# EAGLE board Relay-Board_Rack-PDU_2.0 (EAGLE 9.2.1)
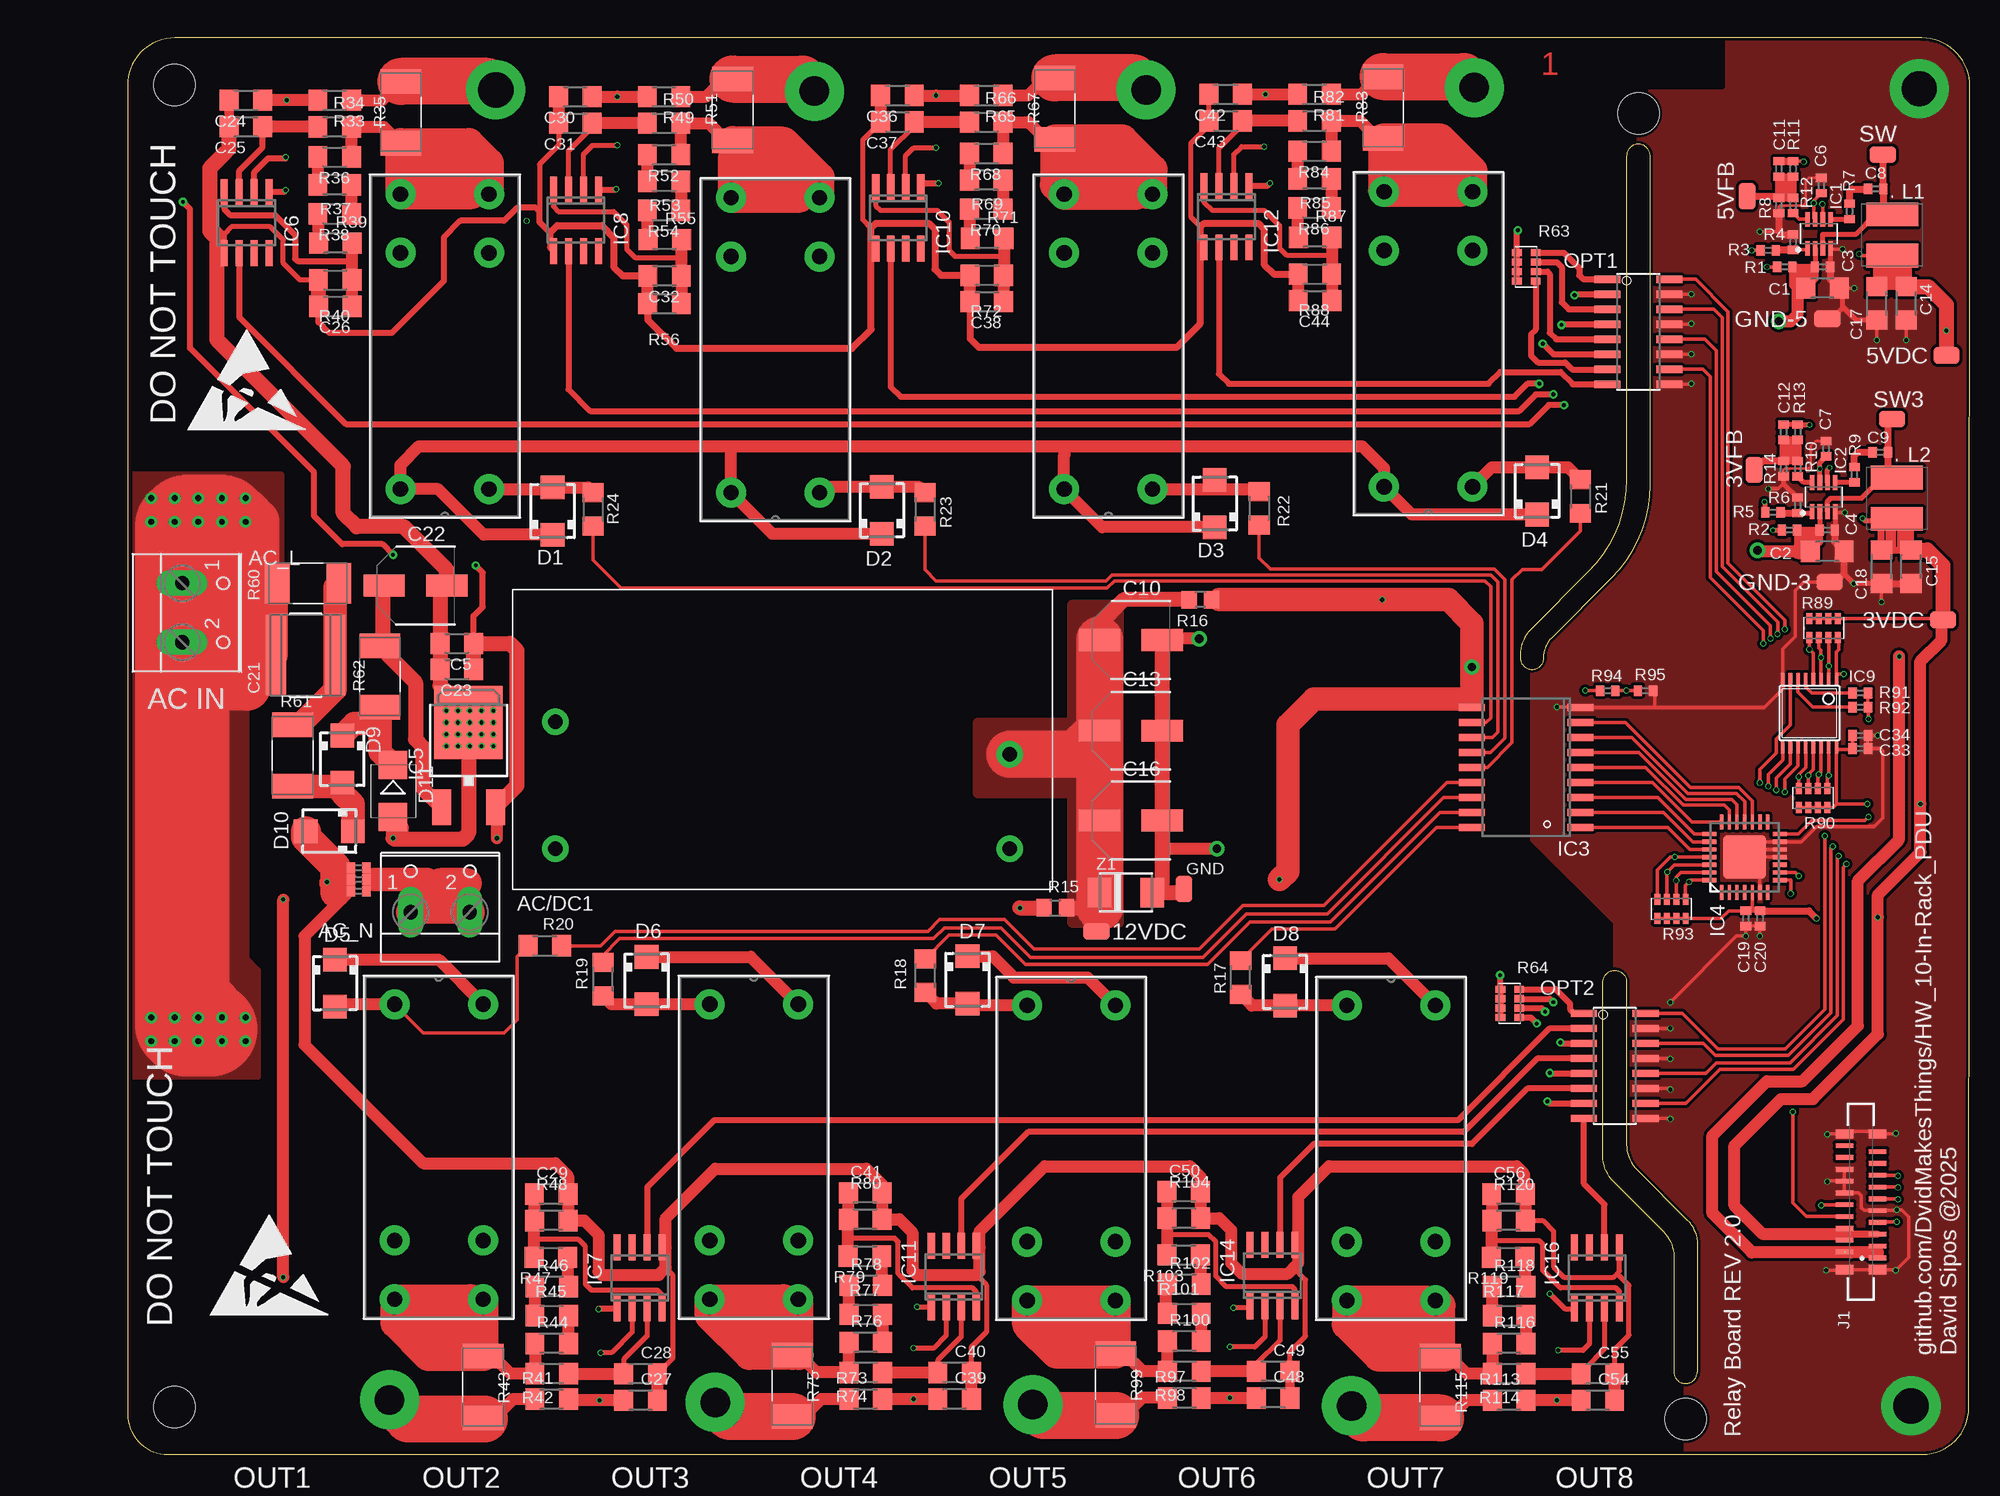
[diagram p3: board, top side]
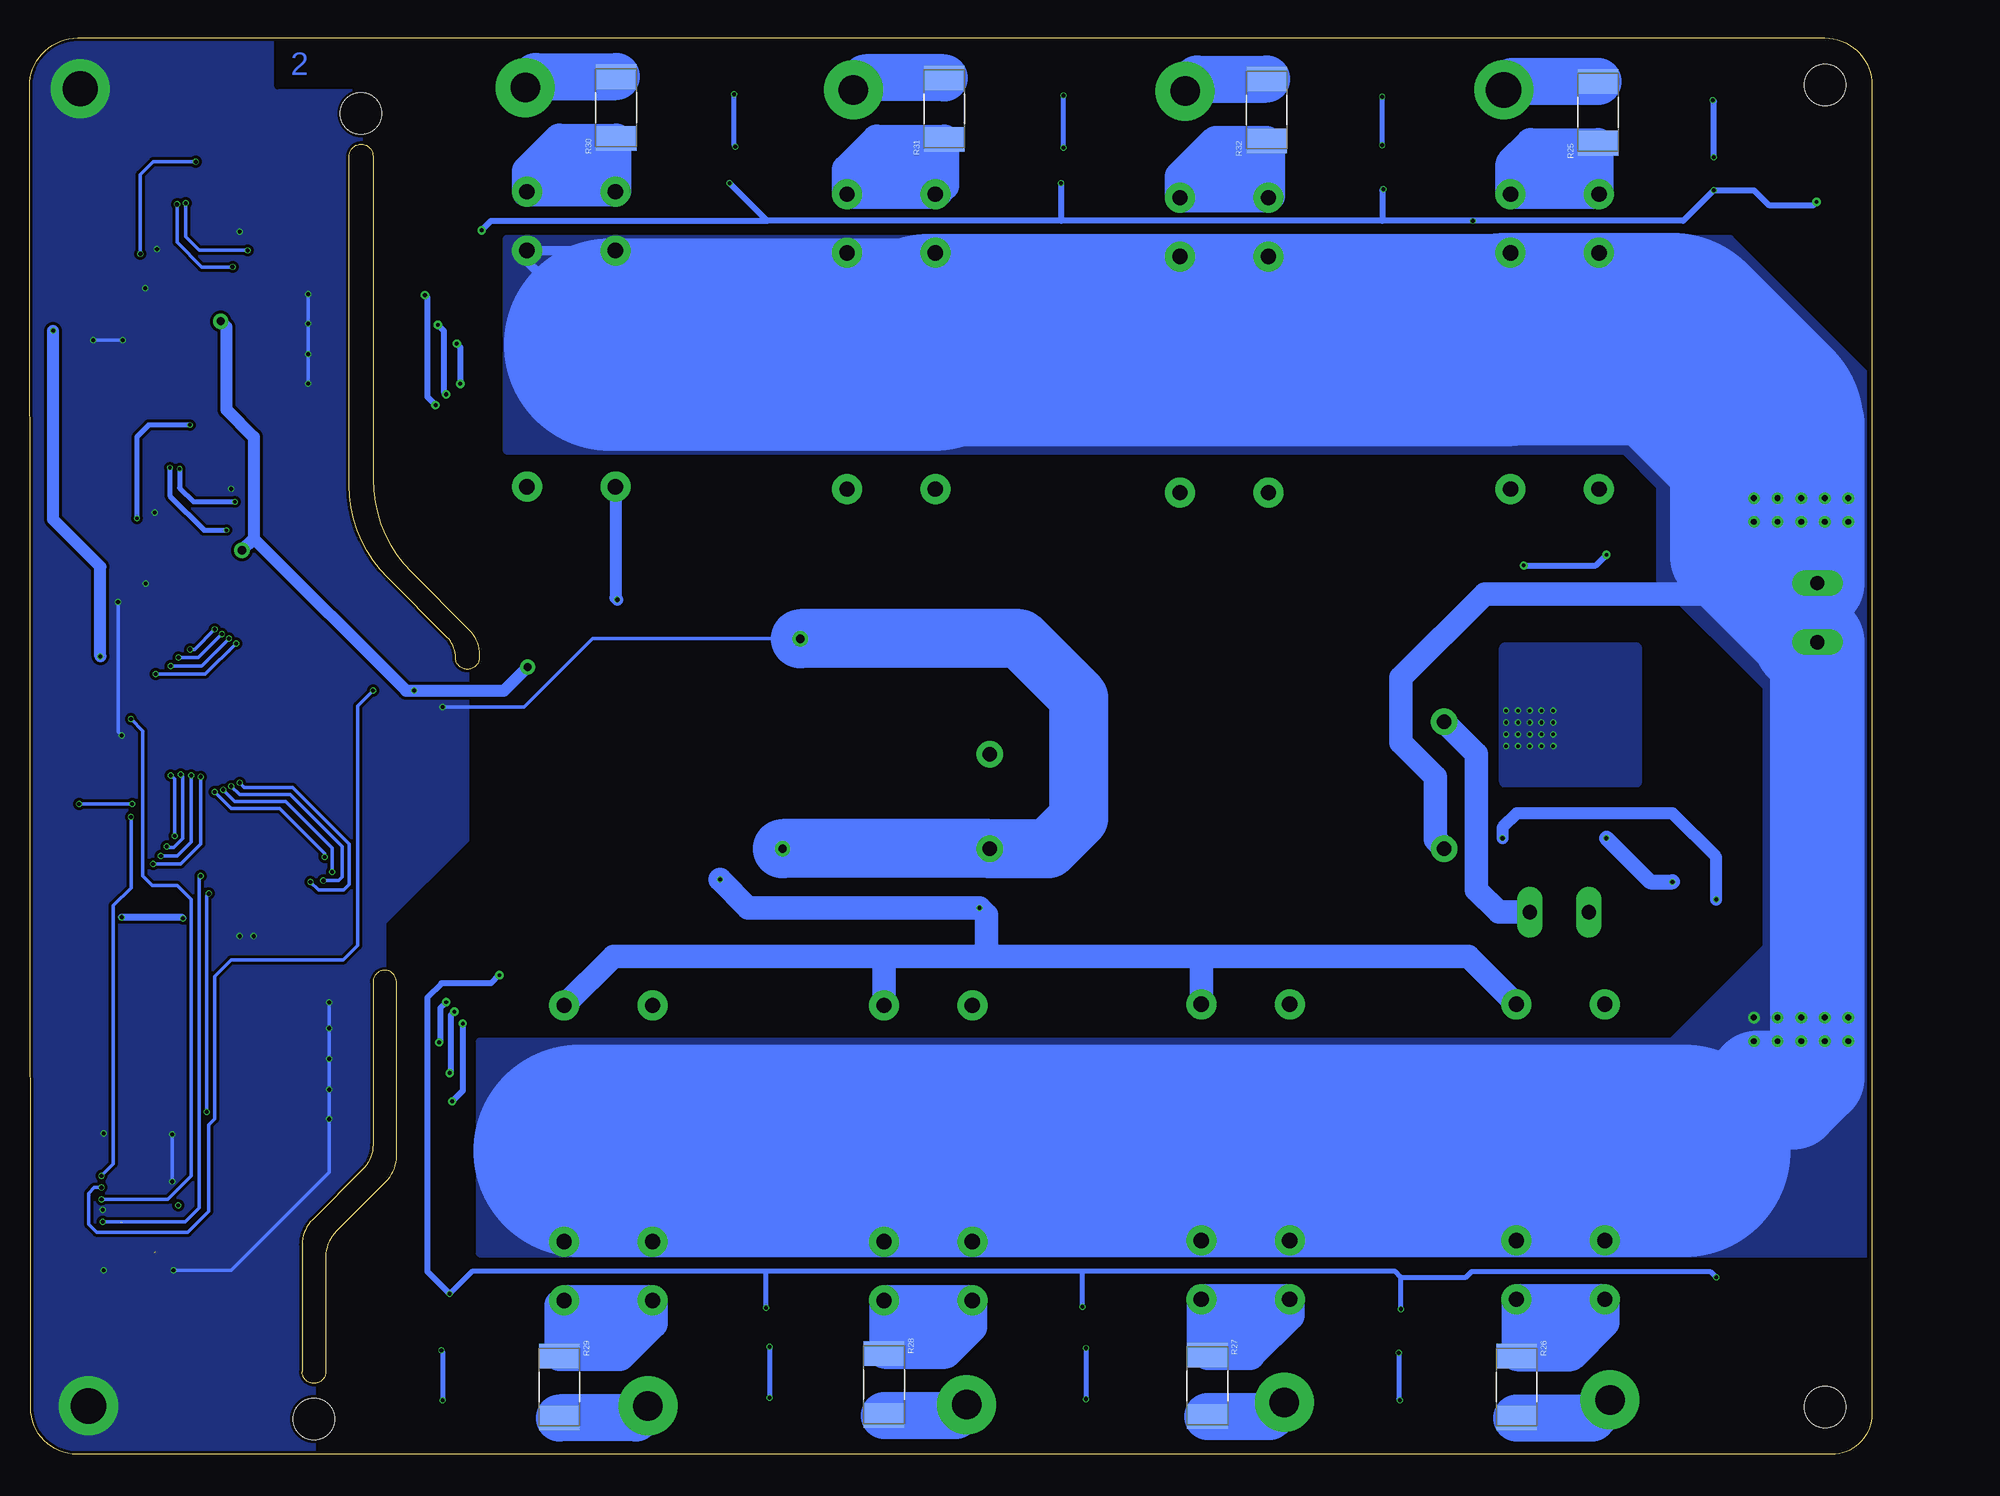
[diagram p4: board, bottom side, seen from below]

Size 156.1 x 120 mm. Coordinates in mm from the lower left corner, seen from the top.
Outline: 3.41,0 152.07,0 arc90 156,3.92 156.1,115.91 arc90 152.01,120 4,120 arc90 0,116 0,3.41 arc90 3.41,0
Outline: 120,67.5 arc-45 120.71,69.21 125.72,74.22 arc45 129,82.14 129,110 arc90 128,111 arc90 127,110 127,82.61 arc-45 123.74,74.74 118.88,69.88 arc45 118,67.76 118,67.5 arc90 119,66.5 arc90 120,67.5
Outline: 125.88,23.12 130.12,18.88 arc-45 131,16.76 131,7 arc90 132,6 arc90 133,7 133,17.76 arc45 132.12,19.88 127.88,24.12 arc-45 127,26.24 127,40 arc90 126,41 arc90 125,40 125,25.24 arc45 125.88,23.12
Copper layers (1*16): Top 0.035mm / dielectric 1.6mm / Bottom 0.035mm
Design rules "jlcpcb-2layers": minimum track width 5mil, minimum drill 0.3mm, track to track 5mil, track to pad 5mil, pad to pad 5mil, via to via 5mil, smd to smd 5mil, copper to edge 0.2mm, drill to drill 6mil, minimum pad ring 10mil, minimum via ring 3mil, stop-mask expansion 4mil, vias tented up to drill 0mil, thermal gap 10mil
Net classes: 0 default: width 0.2 mm, drill 0.3 mm, clearance 0.191 mm
Holes 3.5 mm at 4,116 4,4 132,3 128,113.6

## Footprints (pad centres in the part's own frame; a part is rotated, then mirrored left to right if it is on the bottom)
TP = smd 2.2 x 1.4: TP 0,0
IRM_10_12 = drill 1.24: +V 19.25,0.02; -V 19.25,-7.98; AC_L -19.25,-7.98; AC_N -19.25,2.77
W237-102 = drill 1.194 long: 1 -2.5,-1.27; 2 2.5,-1.27
C1206 = smd 1.6 x 1.803: 1 -1.422,0; 2 1.422,0
0402 = smd 0.7 x 0.9: 1 -0.65,0; 2 0.65,0
100UF-16V = smd 3.5 x 1.85: 1 -2.65,0; 2 2.65,0
C0402 = smd 0.7 x 0.9: 1 -0.65,0; 2 0.65,0
2225 = smd 1.706 x 6.8: 1 -2.503,0; 2 2.503,0
SMA = smd 2 x 2: A 2,0; C -2,0
SMB = smd 2.4 x 2.4: A 2.2,0; C -2.2,0
SOT65P280X110-8N = smd 1.259 x 0.4: 1 -1.228,0.975; 2 -1.228,0.325; 3 -1.228,-0.325; 4 -1.228,-0.975; 5 1.228,-0.975; 6 1.228,-0.325; 7 1.228,0.325; 8 1.228,0.975
SO18 = smd 0.6 x 2.2: 1 -5.08,-4.6; 2 -3.81,-4.6; 3 -2.54,-4.6; 4 -1.27,-4.6; 5 0,-4.6; 6 1.27,-4.6; 7 2.54,-4.6; 8 3.81,-4.6; 9 5.08,-4.6; 10 5.08,4.6; 11 3.81,4.6; 12 2.54,4.6; 13 1.27,4.6; 14 0,4.6; 15 -1.27,4.6; 16 -2.54,4.6; 17 -3.81,4.6; 18 -5.08,4.6
QFN28[6X6]ML = smd 1.27 x 0.35: 1 -2.985,1.95; 2 -2.985,1.3; 3 -2.985,0.65; 4 -2.985,0; 5 -2.985,-0.65; 6 -2.985,-1.3; 7 -2.985,-1.95; 15 2.985,-1.95; 16 2.985,-1.3; 17 2.985,-0.65; 18 2.985,0; 19 2.985,0.65; 20 2.985,1.3; 21 2.985,1.95 | smd 0.35 x 1.27: 8 -1.95,-2.985; 9 -1.3,-2.985; 10 -0.65,-2.985; 11 0,-2.985; 12 0.65,-2.985; 13 1.3,-2.985; 14 1.95,-2.985; 22 1.95,2.985; 23 1.3,2.985; 24 0.65,2.985; 25 0,2.985; 26 -0.65,2.985; 27 -1.3,2.985; 28 -1.95,2.985 | smd 3.7 x 3.7: PAD 0,0
DPAK = smd 1.6 x 3: 1 -2.28,-6.07; 3 2.28,-6.07 | smd 5.8 x 6.2: 4 0,1.11
SO8 = smd 0.6 x 2.2: 1 -1.905,-2.6; 2 -0.635,-2.6; 3 0.635,-2.6; 4 1.905,-2.6; 5 1.905,2.6; 6 0.635,2.6; 7 -0.635,2.6; 8 -1.905,2.6
TSSOP16 = smd 0.305 x 0.991: 1 -2.275,-2.918; 2 -1.625,-2.918; 3 -0.975,-2.918; 4 -0.325,-2.918; 5 0.325,-2.918; 6 0.975,-2.918; 7 1.625,-2.918; 8 2.275,-2.918; 9 2.275,2.918; 10 1.625,2.918; 11 0.975,2.918; 12 0.325,2.918; 13 -0.325,2.918; 14 -0.975,2.918; 15 -1.625,2.918; 16 -2.275,2.918
FPC20 = smd 0.4 x 1.5: 1 -4.552,-1.362; 2 -4.052,1.438; 3 -3.552,-1.362; 4 -3.052,1.438; 5 -2.552,-1.362; 6 -2.052,1.438; 7 -1.552,-1.362; 8 -1.052,1.438; 9 -0.552,-1.362; 10 -0.052,1.438; 11 0.448,-1.362; 12 0.948,1.438; 13 1.448,-1.362; 14 1.948,1.438; 15 2.448,-1.362; 16 2.948,1.438; 17 3.448,-1.362; 18 3.948,1.438; 19 4.448,-1.362; 20 4.948,1.438 | smd 0.8 x 1.5: Z1 -5.552,-1.362; Z2 -5.552,1.438; Z3 5.948,-1.362; Z4 5.948,1.438
RELAY_G2RL-1A-E_DC5_OMR = drill 1.295 pad 2.54: 1 -3.683,12.776; 3 -3.683,-7.239; 4 -3.683,-12.217; 5 3.81,-12.217; 6 3.81,-7.239; 8 3.81,12.776
SRR5228A = smd 4.4 x 2: 1 0,1.75; 2 0,-1.75
SO16 = smd 0.61 x 2.21: 1 -4.445,-2.616; 2 -3.175,-2.616; 3 -1.905,-2.616; 4 -0.635,-2.616; 5 0.635,-2.616; 6 1.905,-2.616; 7 3.175,-2.616; 8 4.445,-2.616; 9 4.445,2.616; 10 3.175,2.616; 11 1.905,2.616; 12 0.635,2.616; 13 -0.635,2.616; 14 -1.905,2.616; 15 -3.175,2.616; 16 -4.445,2.616
0805 = smd 1.3 x 1.5: 1 -0.95,0; 2 0.95,0
1206 = smd 1.6 x 1.803: 1 -1.422,0; 2 1.422,0
2512 = smd 2.08 x 3.44: 1 -2.616,0; 2 2.616,0
742C083103JP = smd 0.59 x 0.92: 1 -1.2,-0.8; 2 -0.4,-0.8; 3 0.4,-0.8; 4 1.2,-0.8; 5 1.2,0.8; 6 0.4,0.8; 7 -0.4,0.8; 8 -1.2,0.8
SUPRESSOR_SMAJ = smd 2 x 2.5: A 2.223,0; C -2.223,0

## Placement (x,y rotation side)
3VDC  TP  [TP]  153.8,70.7 180 top
3VFB  TP  [TP]  137.8,83.4 270 top
5VDC  TP  [TP]  154.1,93.1 180 top
5VFB  TP  [TP]  137.2,106.6 270 top
12VDC  TP  [TP]  82.1,44.3 0 top
AC/DC1  IRM_10_12  [IRM_10_12]  55.5,59.3 0 top
AC_L  [W237-102]  5.9,71.3 270 top
AC_N  [W237-102]  26.5,47.2 0 top
C1  22uF 25V  [C1206]  143.6,98.8 0 top
C2  22uF 25V  [C1206]  144,76.5 0 top
C3  100nF  [0402]  143.6,100.6 0 top
C4  100nF  [0402]  144,78.3 0 top
C5  10uF 16V  [C1206]  27.9,68.7 180 top
C6  100nF  [0402]  143.5,107.5 90 top
C7  100nF  [0402]  143.9,85.2 90 top
C8  100nF  [0402]  148.1,107.2 0 top
C9  100nF  [0402]  148.5,84.9 0 top
C10  100uF  [100UF-16V]  85,69 0 top
C11  33pF  [0402]  139.9,108.9 270 top
C12  33pF  [0402]  140.3,86.6 270 top
C13  100uF  [100UF-16V]  85,61.3 0 top
C14  22uF - 10V  [C1206]  150.7,97.5 270 top
C15  22uF - 10V  [C1206]  151.1,75.2 270 top
C16  100uF  [100UF-16V]  85,53.7 0 top
C17  22uF - 10V  [C1206]  148.2,97.5 270 top
C18  22uF - 10V  [C1206]  148.6,75.2 270 top
C19  100nF  [C0402]  137.1,45.4 270 top
C20  100nF  [C0402]  138.3,45.4 270 top
C21  470nF 630V  [2225]  15.1,67.7 0 top
C22  470uF 25V  [100UF-16V]  24.4,73.6 0 top
C23  10uF 16V  [C1206]  27.9,66.5 180 top
C24  33nF  [C1206]  10.03,114.72 180 top
C25  33nF  [C1206]  10.03,112.48 180 top
C26  33nF  [C1206]  17.6,97.25 180 top
C27  33nF  [C1206]  43.47,4.58 0 top
C28  33nF  [C1206]  43.47,6.82 0 top
C29  33nF  [C1206]  35.9,22.05 0 top
C30  33nF  [C1206]  37.93,115.02 180 top
C31  33nF  [C1206]  37.93,112.78 180 top
C32  33nF  [C1206]  45.5,99.85 180 top
C33  100nF  [C0402]  146.8,59.8 0 top
C34  100nF  [C0402]  146.8,60.9 0 top
C36  33nF  [C1206]  65.23,115.12 180 top
C37  33nF  [C1206]  65.23,112.88 180 top
C38  33nF  [C1206]  72.8,97.65 180 top
C39  33nF  [C1206]  70.07,4.68 0 top
C40  33nF  [C1206]  70.07,6.92 0 top
C41  33nF  [C1206]  62.5,22.15 0 top
C42  33nF  [C1206]  93.03,115.22 180 top
C43  33nF  [C1206]  93.03,112.98 180 top
C44  33nF  [C1206]  100.6,97.75 180 top
C48  33nF  [C1206]  97.07,4.78 0 top
C49  33nF  [C1206]  97.07,7.02 0 top
C50  33nF  [C1206]  89.5,22.25 0 top
C54  33nF  [C1206]  124.57,4.58 0 top
C55  33nF  [C1206]  124.57,6.82 0 top
C56  33nF  [C1206]  117,22.05 0 top
D1  MBRA340T3G  [SMA]  36.02,79.91 90 top
D2  MBRA340T3  [SMA]  63.92,79.98 90 top
D3  MBRA340T3  [SMA]  92.12,80.55 90 top
D4  MBRA340T3  [SMA]  119.42,81.62 90 top
D5  MBRA340T3  [SMA]  17.58,39.91 270 top
D6  MBRA340T3  [SMA]  43.98,40.14 270 top
D7  MBRA340T3  [SMA]  71.17,40.19 270 top
D8  MBRA340T3  [SMA]  98.07,40.02 270 top
D9  S1M  [SMA]  18.2,58.9 270 top
D10  S1M  [SMA]  17.1,52.8 180 top
D11  9.1V 1W  [SMB]  22.5,56.2 270 top
GND  TP  [TP]  89.5,47.9 90 top
GND-3  TP  [TP]  144.2,73.9 180 top
GND-5  TP  [TP]  144,96.2 0 top
IC1  MP2315GJ-Z  [SOT65P280X110-8N]  143.3,103.4 90 top
IC2  MP2315S  [SOT65P280X110-8N]  143.7,81.1 90 top
IC3  ULN2803A  [SO18]  118.5,58.2 90 top
IC4  MCP23017-E/ML  [QFN28[6X6]ML]  137,50.6 90 top
IC5  BA50BC0FP-E2  [DPAK]  28.9,60.9 0 top
IC6  HLW8032  [SO8]  10.1,104.35 180 top
IC7  HLW8032  [SO8]  43.4,14.95 0 top
IC8  HLW8032  [SO8]  38,104.55 180 top
IC9  SN74HC151PWR  [TSSOP16]  142.5,62.8 180 top
IC10  HLW8032  [SO8]  65.3,104.75 180 top
IC11  HLW8032  [SO8]  70,15.05 0 top
IC12  HLW8032  [SO8]  93.1,104.85 180 top
IC14  HLW8032  [SO8]  97,15.15 0 top
IC16  HLW8032  [SO8]  124.5,14.95 0 top
J1  FPC20-H  [FPC20]  146.9,21.2 90 top
K1  G2RL-1A-E_DC12  [RELAY_G2RL-1A-E_DC5_OMR]  26.94,94.55 180 top
K2  G2RL-1A-E_DC12  [RELAY_G2RL-1A-E_DC5_OMR]  54.95,94.25 180 top
K3  G2RL-1A-E_DC12  [RELAY_G2RL-1A-E_DC5_OMR]  83.16,94.55 180 top
K4  G2RL-1A-E_DC12  [RELAY_G2RL-1A-E_DC5_OMR]  110.27,94.75 180 top
K5  G2RL-1A-E_DC12  [RELAY_G2RL-1A-E_DC5_OMR]  26.32,25.35 0 top
K6  G2RL-1A-E_DC12  [RELAY_G2RL-1A-E_DC5_OMR]  53.01,25.35 0 top
K7  G2RL-1A-E_DC12  [RELAY_G2RL-1A-E_DC5_OMR]  79.9,25.25 0 top
K8  G2RL-1A-E_DC12  [RELAY_G2RL-1A-E_DC5_OMR]  106.99,25.25 0 top
L1  4.9uH  [SRR5228A]  149.5,103.3 0 top
L2  4.2uH  [SRR5228A]  149.9,81 0 top
OPT1  TLP291-4  [SO16]  128,95.1 270 top
OPT2  TLP291-4  [SO16]  126,32.9 270 top
R1  499K  [0402]  140.4,100.6 180 top
R2  499K  [0402]  140.8,78.3 180 top
R3  100K  [0402]  139,102 0 top
R4  9.09K  [0402]  141.1,102.7 90 top
R5  100K  [0402]  139.4,79.8 0 top
R6  7.5K  [0402]  141.5,80.4 90 top
R7  10R  [0402]  145.9,105.3 270 top
R8  20K  [0402]  141.1,105.8 90 top
R9  10R  [0402]  146.3,83 270 top
R10  33K  [0402]  141.5,83.5 90 top
R11  40.2K  [0402]  141.1,108.9 270 top
R12  7.5K  [0402]  139.9,105.8 270 top
R13  40.2K  [0402]  141.5,86.6 270 top
R14  12.7K  [0402]  140.3,83.5 270 top
R15  0R  [0805]  78.6,46.3 0 top
R16  0R  [0805]  90.9,72.4 180 top
R17  330R 1W  [1206]  94.3,40.4 270 top
R18  330R 1W  [1206]  67.59,40.55 270 top
R19  330R 1W  [1206]  40.3,40.25 270 top
R20  330R 1W  [1206]  35.35,43.09 180 top
R21  330R 1W  [1206]  123.08,81.15 90 top
R22  330R 1W  [1206]  95.87,80.15 90 top
R23  330R 1W  [1206]  67.56,80.05 90 top
R24  330R 1W  [1206]  39.45,80.05 90 top
R25  0.002R 1%  [2512]  23.2,113.7 90 bottom
R26  0.002R 1%  [2512]  30.1,5.7 270 bottom
R27  0.002R 1%  [2512]  56.3,5.8 270 bottom
R28  0.002R 1%  [2512]  83.7,5.9 270 bottom
R29  0.002R 1%  [2512]  111.2,5.7 270 bottom
R30  0.002R 1%  [2512]  106.4,114.1 90 bottom
R31  0.002R 1%  [2512]  78.6,114 90 bottom
R32  0.002R 1%  [2512]  51.3,113.9 90 bottom
R33  1K 1%  [1206]  17.56,114.73 180 top
R34  1K 1%  [1206]  17.56,112.47 180 top
R35  0.002R 1%  [2512]  23.17,113.7 90 top
R36  470K  [1206]  17.56,109.91 180 top
R37  470K  [1206]  17.56,107.55 0 top
R38  470K  [1206]  17.56,105.09 180 top
R39  470K  [1206]  17.62,102.61 0 top
R40  1K 1%  [1206]  17.6,99.49 180 top
R41  1K 1%  [1206]  35.94,4.67 0 top
R42  1K 1%  [1206]  35.94,6.83 0 top
R43  0.002R 1%  [2512]  30.13,5.7 270 top
R44  470K  [1206]  35.94,9.39 0 top
R45  470K  [1206]  35.94,11.75 180 top
R46  470K  [1206]  35.94,14.21 0 top
R47  470K  [1206]  35.88,16.69 180 top
R48  1K 1%  [1206]  35.9,19.81 0 top
R49  1K 1%  [1206]  45.46,115.03 180 top
R50  1K 1%  [1206]  45.46,112.77 180 top
R51  0.002R 1%  [2512]  51.27,113.9 90 top
R52  470K  [1206]  45.46,110.11 180 top
R53  470K  [1206]  45.46,107.85 0 top
R54  470K  [1206]  45.46,105.39 180 top
R55  470K  [1206]  45.52,102.91 0 top
R56  1K 1%  [1206]  45.5,97.49 180 top
R57  JP  [0402]  19.6,48.7 180 top
R58  JP  [0402]  19.6,49.7 180 top
R59  JP  [0402]  19.6,47.7 180 top
R60  470K 1W  [2512]  15.3,73.8 0 top
R61  100R 1W  [2512]  14,59.2 270 top
R62  100R 1W  [2512]  21.4,65.9 90 top
R63  4x1K 1206  [742C083103JP]  118.5,100.6 270 top
R64  4x1K 1206  [742C083103JP]  117.1,38.2 270 top
R65  1K 1%  [1206]  72.76,115.13 180 top
R66  1K 1%  [1206]  72.76,112.87 180 top
R67  0.002R 1%  [2512]  78.57,114 90 top
R68  470K  [1206]  72.76,110.21 180 top
R69  470K  [1206]  72.76,107.95 0 top
R70  470K  [1206]  72.76,105.49 180 top
R71  470K  [1206]  72.82,103.01 0 top
R72  1K 1%  [1206]  72.8,99.89 180 top
R73  1K 1%  [1206]  62.54,4.67 0 top
R74  1K 1%  [1206]  62.54,6.93 0 top
R75  0.002R 1%  [2512]  56.33,5.8 270 top
R76  470K  [1206]  62.54,9.49 0 top
R77  470K  [1206]  62.54,11.85 180 top
R78  470K  [1206]  62.54,14.31 0 top
R79  470K  [1206]  62.48,16.79 180 top
R80  1K 1%  [1206]  62.5,19.91 0 top
R81  1K 1%  [1206]  100.56,115.23 180 top
R82  1K 1%  [1206]  100.56,112.97 180 top
R83  0.002R 1%  [2512]  106.37,114.1 90 top
R84  470K  [1206]  100.56,110.41 180 top
R85  470K  [1206]  100.56,108.05 0 top
R86  470K  [1206]  100.56,105.59 180 top
R87  470K  [1206]  100.62,103.11 0 top
R88  1K 1%  [1206]  100.6,99.99 180 top
R89  4x1K 1206  [742C083103JP]  143.7,70 0 top
R90  4x1K 1206  [742C083103JP]  142.8,55.6 180 top
R91  0R  [0402]  146.8,64.5 0 top
R92  0R  [0402]  146.8,63.3 0 top
R93  4x10K 1206  [742C083103JP]  130.8,46.2 180 top
R94  100K  [0402]  125.4,64.7 180 top
R95  10K  [0402]  128.6,64.7 180 top
R97  1K 1%  [1206]  89.54,4.77 0 top
R98  1K 1%  [1206]  89.54,7.03 0 top
R99  0.002R 1%  [2512]  83.73,5.9 270 top
R100  470K  [1206]  89.54,9.59 0 top
R101  470K  [1206]  89.54,11.95 180 top
R102  470K  [1206]  89.54,14.41 0 top
R103  470K  [1206]  89.48,16.89 180 top
R104  1K 1%  [1206]  89.5,20.01 0 top
R113  1K 1%  [1206]  117.04,4.57 0 top
R114  1K 1%  [1206]  117.04,6.83 0 top
R115  0.002R 1%  [2512]  111.23,5.7 270 top
R116  470K  [1206]  117.04,9.39 0 top
R117  470K  [1206]  117.04,11.75 180 top
R118  470K  [1206]  117.04,14.21 0 top
R119  470K  [1206]  116.98,16.69 180 top
R120  1K 1%  [1206]  117,19.81 0 top
SW  TP  [TP]  148.7,110.1 180 top
SW3  TP  [TP]  149.5,87.7 180 top
U$1  [ESD_10.00]  6.9,11.7 0 top
U$2  [ESD_10.00]  5,86.7 0 top
U$3  [2-LAYER]  118.6,115.9 0 top
Z1  SMAJ15A  [SUPRESSOR_SMAJ]  84.6,47.6 0 top

## Tracks (layer width: path | path; a pad name or v marks a point on that pad's centre or on a via)
5VFB
  Top 0.61: R12.1 140.4,106.45 | 140.4,106.45 R8.2 | R12.1 C11.2 | C11.2 140.8,108.25 | 140.8,108.25 R11.2 R8.2 | C11.2 140.4,107.75 140.4,106.45 | R8.2 140.8,106.75 140.8,108.25 | 5VFB.TP 139.75,106.6 R12.1
+3V3  (via drill 0.3 pad 0.45, 0.35 pad 0.45)
  Top 0.2: J1.4 145.1,18.35 145.1,18.65
  Top 0.305: IC4.5 137.65,46.35 | 137.5,46.05 C19.1 135.65,46.05 135,45.4 R93.8 R93.7 R93.6 R93.5 | 137.5,46.05 137.95,46.05 | 137.95,46.05 C20.1 | 137.65,46.35 137.5,46.2 137.5,46.05 | 137.65,46.35 137.95,46.05 | IC9.16 144.78,59.7 | 144.78,59.7 144.78,55.08 | 144.78,55.08 144.5,54.8 R90.8 R90.7 R90.6 R90.5 | 144.78,59.7 146.05,59.7 C33.1 C34.1 | R89.8 R89.7 R89.6 R89.5 153.7,70.8 3VDC.TP | J1.4 J1.6 | 144.78,55.08 144.8,55.1 v147.4,55.1
  Top 0.406: C12.1 R13.1 142.45,87.25 v142.5,87.2 | v147,79.3 147.2,79.1 149,79.1
  Top 0.61: 149.2,76.62 C18.1 148.6,78.9 148.4,79.1 149,79.1 149.75,79.1 L2.2 | 149.2,76.62 149.7,76.62 | 149.7,76.62 150.2,76.62 | 150.2,76.62 C15.1 | L2.2 149.57,78.92 | 149.57,78.92 149.2,78.55 149.2,76.62 | 149.7,76.62 149.57,76.75 149.57,78.92 | L2.2 150.2,78.95 150.2,78.3 | 150.2,78.3 150.2,76.62 | L2.2 150.72,78.42 150.72,77 C15.1 | C15.1 151.1,79.2 | 151.1,79.2 151.2,79.3 | 151.1,79.2 150.2,78.3 | C20.1 142.44,46.05 v143.09,45.4 | J1.5 145.1,18.65
  Top 1.016: 145.1,18.65 138.55,18.65 136.13,21.07 136.13,26.13 140.1,30.1 142.8,30.1 148.3,35.6 v148.3,45.5 148.3,47.4 151.9,51 v151.9,55.1 151.9,67.2 153.7,69 153.7,70.8
  Top 1.27: C15.1 152.48,76.62 153.8,75.3 3VDC.TP
  Bottom 0.305: v147.4,55.1 v151.9,55.1
  Bottom 0.406: v142.5,87.2 146,87.2 147,86.2 v147,79.3
  Bottom 0.61: v143.09,45.4 143.19,45.5 v148.3,45.5
+5V  (via drill 0.35 pad 0.45)  (1 unrouted)
  Top 0.305: R11.1 141.95,109.55 v142,109.5 | v146.7,101.7 146.85,101.55 148.8,101.55 | 148.26,16.85 148.3,17.07 | 148.3,17.07 148.3,17.1 | 145.46,17.35 145.55,17.1 146,17.1 | 148.3,17.07 148.3,17.61 J1.3 | 148.3,17.07 148.3,16.68 J1.1
  Top 0.61: C17.1 148.2,100 | 148.2,100 148.2,100.5 | 148.2,100.5 148.2,101.4 148.05,101.55 | 148,101.6 148.05,101.55 | 148.05,101.55 148.8,101.55 L1.2 150,101.05 150,100.5 | C14.1 150.9,99.12 150.9,99.4 | 150.9,99.4 150.9,99.9 | 150.9,99.9 150.9,100.4 150.5,100.4 150.4,100.5 150,100.5 | 150,100.5 148.2,100.5 | 150.9,99.9 150.6,99.9 | 150.6,99.9 148.3,99.9 148.2,100 | C17.1 148.68,99.4 150.9,99.4 | C14.1 C17.1 | C14.1 150.7,99.8 150.6,99.9 | C11.1 R11.1
  Top 1.016: 148.3,17.1 146,17.1 137.6,17.1 134.29,20.41 134.29,26.99 138.9,31.6 141.9,31.6 146.6,36.3 146.6,48.6 150.1,52.1 v150.1,67.6
  Top 1.27: C14.1 152.58,98.92 154.1,97.4 v154.1,95.2 5VDC.TP
  Bottom 0.305: v142,109.5 145.6,109.5 146.7,108.4 v146.7,101.7
  Bottom 1.016: v150.1,67.6 150.1,75.2 154.1,79.2 v154.1,95.2
+5V_MEA  (via drill 0.3 pad 0.7, 0.35 pad 0.45, 0.35 pad 0.7)
  Top 0.406: v120.5,13.6 121.75,12.35 IC16.1 | IC14.1 94.95,12.4 v93.7,12.4 | IC11.1 66.95,12.45 v66.9,12.5
  Top 0.508: IC7.1 39.95,12.35 v39.9,12.3 | IC6.1 13.25,106.95 v13.4,107.1 | v96.8,107.7 96.55,107.45 IC12.1 | IC10.1 67.55,107.7 v68.7,107.7 | IC8.1 41.35,107.15 v41.4,107.2 | C5.1 29.32,71.02 30.1,71.8 30.1,74.7 v29.5,75.3 | v22.5,76.2 21.6,77.1 18.2,77.1 15.8,79.5 15.8,83.2 5.3,93.7 5.3,105.5 v4.7,106.1 | R63.4 R63.3 R63.2 R63.1 117.7,103.6 v117.8,103.7 | R64.4 R64.3 R64.2 R64.1 v116.3,40.6
  Top 1.016: v13.2,15 v13.2,47 | v31.3,52.2 31.3,54.71 IC5.3
  Top 1.27: C23.1 C5.1 32.4,68.7 33,68.1 33,56.65 IC5.3
  Bottom 0.406: v39.9,12.3 39.9,15 | 39.9,15 40.4,15.5 66.8,15.5 | v120.5,13.6 118.6,15.5 93.6,15.5 | 66.8,15.5 93.6,15.5 | v93.7,12.4 93.7,15.4 93.6,15.5 | v66.9,12.5 66.9,15.4 66.8,15.5 | 39.9,15 34.4,15 33.9,15.5 13.7,15.5 v13.2,15
  Bottom 0.508: 41.5,104.5 v33.8,104.5 16,104.5 v13.4,107.1 10,107.1 8.7,105.8 5,105.8 v4.7,106.1 | 41.5,104.5 68.7,104.5 | 68.7,104.5 93.6,104.5 | 93.6,104.5 v96.8,107.7 | v68.7,107.7 68.7,104.5 | v41.4,107.2 41.5,107.1 41.5,104.5 | v29.5,75.3 23.4,75.3 v22.5,76.2 | v117.8,103.7 117,104.5 93.6,104.5 | v116.3,40.6 117,39.9 121.2,39.9 122.4,38.7 122.4,15.5 v120.5,13.6
  Bottom 1.016: v13.2,47 13.2,50.6 16.9,54.3 30.1,54.3 31.3,53.1 v31.3,52.2
+12V  (via drill 0.35 pad 0.45, 0.7 pad 1.3)
  Top 0.305: IC3.10 113.9,64 | R94.2 v123.5,64.7
  Top 0.406: IC1.2 142.97,100.6 C3.1 142.95,100.1 142.95,99.8 142.95,99.57 | 142.54,99.16 C1.1 | IC2.2 143.38,78.33 C4.1 143.1,78.3 | 142.2,78.3 141.7,78.3 R2.1
  Top 0.508: 142,76 141.5,76.5
  Top 0.61: R1.1 141.05,99.05 141.5,98.6 141.5,99.6 | 141.5,99.6 141.5,100.1 | 141.5,100.1 141.5,100.5 141.4,100.6 C3.1 142.95,99.57 142.54,99.16 | 141.5,100.1 142.95,100.1 | 142.95,99.8 141.7,99.8 141.5,99.6 | 142.89,76.81 143.35,77.27 143.35,77.7 | 142.89,76.81 C2.1 142.09,76.99 | 141.5,76.5 141.45,76.55 R2.1 142.2,78.3 | 142.09,76.99 141.7,77.38 141.7,78.3 | 142.2,78.3 142.7,78.3 | 142.7,78.3 143.1,78.3 | 142.2,78.3 142.09,78.19 142.09,76.99 | 142.7,78.3 142.7,77.9 | 142.7,77.9 142.7,77 142.89,76.81 | C4.1 143.35,77.7 | 142.7,77.9 142.9,77.7 143.35,77.7
  Top 1.016: 51.1,85.4 24.7,85.4 23.13,83.83 K1.8 26.33,81.77 30.19,77.91 D1.C | 51.1,85.4 79.2,85.4 | 79.2,85.4 104.6,85.4 106.46,83.54 K4.8 108.81,79.62 D4.C | 79.2,85.4 79.4,85.2 79.4,84.7 79.35,84.65 K3.8 82.57,78.55 D3.C | 51.1,85.4 51.14,85.36 K2.8 54.63,77.98 D2.C | D5.C 26.35,41.91 K5.8 | D6.C 52.81,42.14 K6.8 | D7.C 73.31,42.19 75.1,40.4 81.34,40.4 K7.8 | D8.C 106.81,42.02 K8.8 | v139.9,96 140.9,96 141.5,96.6 141.5,98.6 | 141.5,76.5 138.2,76.5 v138.1,76.6
  Top 1.27: 92.5,72.4 R16.1 | 141.5,76.5 C2.1 | v75.6,46.3 R15.1
  Top 2: 92.5,72.4 v106.3,72.4 111.9,72.4 113.9,70.4 v113.9,66.7 113.9,64 100.5,64 98.3,61.8 98.3,49.4 v97.6,48.7
  Bottom 1.016: K4.8 106.46,72.56 v106.3,72.4 | v113.9,66.7 115.9,64.7 v123.5,64.7 124.2,64.7 137.1,77.6 | v139.9,96 139.4,95.5 139.4,88.5 137.1,86.2 137.1,77.6 | v138.1,76.6 137.1,77.6
  Bottom 2: K5.8 34.2,42.2 56.8,42.2 | K8.8 106.63,42.2 83.8,42.2 | 56.8,42.2 75,42.2 | 75,42.2 83.8,42.2 | K6.8 56.82,42.18 56.8,42.2 | K7.8 83.71,42.11 83.8,42.2 | 75,42.2 75,45.7 v75.6,46.3 95.2,46.3 v97.6,48.7
+12V_MEA  (via drill 0.35 pad 0.45)
  Top 0.305: R94.1 v127,64.7 R95.2 | 149.95,22.65 v150,22.6 149.95,22.65 J1.13
  Bottom 0.305: v127,64.7 128.3,63.4 128.3,43.12 129.52,41.9 139,41.9 140.4,40.5 140.4,28.4 140.9,27.9 140.9,20.6 142.7,18.8 150.4,18.8 151.1,19.5 151.1,22.1 150.6,22.6 v150,22.6
AC_L  (via drill 0.5 pad 1)
  Top 2: C21.1 12.6,73.71 R60.1 10.1,73.8
  Top 4: 9.7,76.3 10.1,75.9 10.1,73.8 10.1,65 7.8,65 | 7.8,65 7.4,64.6 | 7.8,65 10.9,68.1 10.9,79 10,79.9 v10,79
  Top 8: 4.63,38.37 AC_L.2 AC_L.1 4.63,78.63 5,79 v8,79 | 4.63,38.37 4.63,36.37 5,36 7,36 | 4.63,38.37 v6,37
  Bottom 0.508: 11.5,83.4 13.1,83.4
  Bottom 0.813: K4.6 K4.3 113.95,101.05 106.9,94 | K3.3 86.84,101.34 80.6,95.1 | K3.6 82.6,98.54 82.6,95.1 80.6,95.1 | 80.6,95.1 79.9,94.4 79.5,94
  Bottom 1.27: K1.6 30.21,101.79 30.62,101.38 | 31,101 30.62,101.38 | 30.62,101.38 K1.3 30.62,95.62 30,95 30.5,95 31,94.5 31.1,94.4 | K2.6 51.14,95.36 52,94.5 | K2.3 58.63,101.13 52,94.5 | 52,94.5 51.9,94.4 | K5.3 22.64,18.96 15.9,25.7 | K5.6 30.13,24.57 29,25.7 | K6.3 49.33,24.03 51,25.7 56.82,19.88 K6.6 | K7.3 76.22,25.48 76,25.7 76.3,26 82,26 82,19.72 K7.6 | K8.3 103.31,19.51 109.5,25.7 109,26.2 | K8.6 110.8,24.2 109,26 109,26.2 | 109,27 109,26.2 | AC_L.2 5.12,73.71 5.2,74.53
  Bottom 18: 109.5,25.7 76,25.7 51,25.7 29,25.7 15.9,25.7 | 9.7,87.3 16.9,94.5 31,94.5 | 31.1,94.4 51.9,94.4 79.9,94.4 | 106.9,94 79.5,94
  Bottom 2: 12.3,84.2 12.3,84.7 9.7,87.3 | AC/DC1.AC_L 37,52.07 37,57.4 39.9,60.3 39.9,65.8 32.8,72.9 11.6,72.9 10.79,73.71 5.12,73.71
  Bottom 8: AC_L.1 4.63,87.43 5.7,88.5 10.8,83.4 12.6,83.4 6,76.8 6,68.7 | 6,68.7 5.7,68.7 | 5.7,68.7 5.3,68.7 5.2,68.8 | 6,68.7 5.9,68.8 AC_L.2 4.63,31.87 | 5.7,68.7 13.08,76.08 | 13.12,76 11.5,76 11.5,83.4 12.3,84.2 13.1,83.4 13.1,76 | 4.63,31.87 6.7,29.8 | 15.9,25.7 9.73,31.87 4.63,31.87
  other vias: 2,81 2,79 4,79 4,81 6,81 6,79 8,81 10,81 2,37 4,37 8,37 10,37 10,35 8,35 6,35 4,35 2,35
  pour Top (isolate 0.406, rank 2, no thermals): 11,41 11,32 0,32 0,83 13,83 13,66 10,63 10,42
  pour Bottom (isolate 0.406, rank 2, no thermals): 115.7,103 115.7,85 21,85 18,82 18,74 9,65 9,43 17,35 118,35 118,17 0,17 0,91 12,103
AC_N
  Top 0.61: R58.1 R57.1 | R57.1 R59.1 | R57.1 20.9,48.7
  Top 1.27: 26.47,48.4 24.7,48.4 24.4,48.7
  Top 2: AC_N.2 AC_N.1 | 20.9,48.7 24.4,48.7 25.4,48.7 25.54,48.56
  Top 2.54: AC_N.2 26.53,48.4 | 28.77,48.4 26.47,48.4 AC_N.1
  Bottom 2: AC_N.2 31.63,45.93 33.5,47.8 33.5,59.32 AC/DC1.AC_N
AGND  (via drill 0.3 pad 0.5, 0.35 pad 0.45)
  Top 0.406: R120.2 119.89,19.81 120.8,18.9 120.8,15.9 121.7,15 125.9,15 126.2,15.3 | IC16.5 126.41,15.51 126.2,15.3 | IC14.5 98.95,17.7 99.2,17.7 | IC11.5 72.05,17.5 72.2,17.5 | IC7.5 45.35,17.5 45.6,17.5 | 45.6,15.8 46.2,15.2 46.2,8.13 C28.2 | C40.2 71.49,9.09 72.8,10.4 72.8,14.3 71.9,15.2 | C49.2 98.49,8.69 99.8,10 99.8,14.8 98.8,15.8 | C55.2 125.99,8.89 127.2,10.1 127.2,14.3 126.2,15.3 | R40.2 14.61,99.49 13.2,100.9 13.2,102.9 12.1,104 8.8,104 8.2,103.39 8.2,103.3 | 8.2,103.3 IC6.5 | 90.9,104 90.1,104.8 90.1,111.1 91.61,112.61 C43.2 C42.2 | 63,103.9 62.3,104.6 62.3,111.37 C37.2 | C31.2 36.51,110.91 34.9,109.3 34.9,105.3 | 8.61,110.61 8.35,110.35 7.1,109.1 7.1,104.39 8.2,103.3
  Top 0.508: IC8.5 35.8,102.25 35.8,103.5 34.9,104.4 34.9,105.3 34.6,105.6 33,105.6 31.9,104.5 28.2,104.5 26.8,103.1 26.8,99.4 22.4,95 17.1,95 16.18,95.92 C26.2 | IC10.5 63.15,102.15 63,102
  Top 0.61: R57.2 R58.2 18.5,49.7 18.4,49.6 18.4,47.3 18.5,47.4 | 35.8,103.5 36.4,104.1 40.2,104.1 41.2,103.1 41.2,100.6 41.95,99.85 C32.2 | R56.2 44.08,96.12 46.5,93.7 61.4,93.7 63,95.3 63,102 63,103.9 63.4,104.3 67.9,104.3 68.4,103.8 68.4,100.4 68.91,99.89 R72.2 | C38.2 71.38,94.52 72.1,93.8 88.9,93.8 90.9,95.8 90.9,102.3 | R88.2 97.11,99.99 96.3,100.8 96.3,103.8 95.8,104.3 91.2,104.3 90.9,104 90.9,102.3 | IC12.5 91.15,102.3 90.9,102.3 | IC5.4 v29,62 | R57.2 R59.2 | 17.6,47.6 18.7,48.7 R57.2
  Top 0.813: C49.2 C48.2 | C25.2 C24.2
  Top 1.016: R56.2 C32.2 | C30.2 C31.2 | C36.2 C37.2 | C38.2 R72.2 | C44.2 R88.2 | C27.2 C28.2 | C39.2 C40.2 | R120.2 C56.2 118.3,22.17 118.3,23.8 117.7,24.4 101.8,24.4 99.2,21.8 99.2,17.7 99.2,16.2 98.8,15.8 98.3,15.3 94.4,15.3 93.5,16.2 93.5,19 92.49,20.01 R104.2 C50.2 90.92,23.48 90,24.4 77.7,24.4 72.2,18.9 72.2,17.5 72.2,15.5 71.9,15.2 66.9,15.2 66.5,15.6 66.5,18.8 65.39,19.91 R80.2 C41.2 63.92,22.88 62.6,24.2 49.8,24.2 45.6,20 45.6,17.5 45.6,15.8 45,15.2 40.2,15.2 39.9,15.5 39.9,18.6 38.69,19.81 R48.2 C29.2 37.32,23.58 36.25,24.65 25.05,24.65 15,34.7 15,43.9 18.5,47.4 | C54.2 C55.2
  Top 1.27: D11.A v22.5,52.2 22.6,52.1 23.5,52.1 | v16.9,48.5 16.9,48.3 17.6,47.6 | 23.5,52.1 28.4,52.1 28.9,52.6 IC5.4 28.9,62.7 26.48,65.12 C23.2 C5.2 26.48,73.03 C22.2 27.05,74.95 23.4,78.6 19.4,78.6 18.28,79.72 18.28,83.72 7.6,94.4 7.6,103 7,103.6 7,109 8.35,110.35 | 23.5,52.1 23.2,52.4 23.2,53.1 | C26.2 R40.2 | 8.61,110.61 C25.2
  Top 2.54: D10.A 15.1,52.3 17.6,49.8 17.6,47.6
  Bottom 1.27: v22.5,52.2 18.8,48.5 v16.9,48.5
  other vias: 27,63 28,63 29,63 30,63 30,62 30,61 30,60 31,60 31,61 31,62 31,63 28,62 27,62 27,61 27,60 28,60 28,61 29,61 29,60
  pour Bottom (isolate 0.305, rank 2, no thermals): 31.1,61.7 31.1,68.3 20,68.3 20,57 31.1,57
C13_IN1  (via drill 3 pad 5)
  Top 1.016: R33.1 21.58,114.73 R35.2
  Top 1.27: R35.2 25.3,116.32 25.3,116.3
  Top 4: v31.2,115.6 30.48,116.32 R35.2
  Bottom 4: v31.2,115.6 30.48,116.32 R25.2
C13_IN2  (via drill 2.5 pad 5)
  Top 1.016: R49.1 49.03,115.03 50.52,116.52 R51.2
  Top 4: R51.2 57.18,116.52 v58.2,115.5
  Bottom 4: v58.2,115.5 57.18,116.52 R32.2
C13_IN3  (via drill 2.5 pad 5)
  Top 1.016: R65.1 76.33,115.13 77.82,116.62 R67.2
  Top 4: v86.3,115.6 85.28,116.62 R67.2
  Bottom 4: R31.2 85.28,116.62 v86.3,115.6
C13_IN4  (via drill 2.5 pad 5)
  Top 1.016: R81.1 104.53,115.23 106.02,116.72 R83.2
  Top 4: R83.2 113.18,116.72 v114.1,115.8
  Bottom 4: v114.1,115.8 113.18,116.72 R30.2
C13_IN5  (via drill 2.5 pad 5)
  Top 1.016: R41.1 32.67,4.67 31,3 30.22,3 R43.2
  Top 4: v22.2,4.6 23.8,3 30.22,3
  Bottom 4: R26.2 23.72,3.08 v22.2,4.6
C13_IN6  (via drill 2.5 pad 5)
  Top 1.016: R73.1 58.77,4.67 57.28,3.18 R75.2
  Top 4: R75.2 51.02,3.18 v49.8,4.4
  Bottom 4: v49.8,4.4 51.02,3.18 R27.2
C13_IN7  (via drill 2.5 pad 5)
  Top 1.016: R97.1 85.97,4.77 84.48,3.28 R99.2
  Top 4: v76.7,4.2 77.62,3.28 R99.2
  Bottom 4: R28.2 77.62,3.28 v76.7,4.2
C13_IN8  (via drill 2.5 pad 5)
  Top 1.016: R113.1 113.47,4.57 111.98,3.08 R115.2
  Top 4: R115.2 104.72,3.08 v103.7,4.1
  Bottom 4: v103.7,4.1 104.72,3.08 R29.2
GND  (via drill 0.35 pad 0.45, 0.7 pad 1.3, 3 pad 5)
  Top 0.2: R12.2 139.9,105.7 140,105.8 142,105.8 142.2,106 142.2,107.9 142.45,108.15 C6.2 | R14.2 140.3,83.4 140.4,83.5 142.4,83.5 142.6,83.7 142.6,85.4 143.05,85.85 C7.2
  Top 0.305: IC4.6 138.3,49.5 138,49.8 137.8,49.8 137.05,50.55 | 137.05,50.55 IC4.PAD | IC4.11 137.4,50.6 | 137.4,50.6 137.1,50.6 137.05,50.55 | IC4.12 137.65,51.25 137.5,51.4 137.4,51.3 137.4,51.2 | 137.4,51.2 137.4,50.6 | 137.4,51.2 138.1,51.9 IC4.13 141.8,51.9 143.1,53.2 148,53.2 148.7,53.9 148.7,59.6 148.5,59.8 C33.2 C34.2 v148.3,60.9 | OPT1.9 132.46,90.66 v132.5,90.7 | OPT1.11 v132.5,93.19 v132.5,93.2 | OPT1.13 132.44,95.73 v132.5,95.8 | OPT1.15 132.47,98.28 v132.5,98.3 | 129.4,63.28 IC3.9 123.08,63.3 v121.1,63.3 | 129.4,63.28 138.68,63.28 140.22,64.83 IC9.8 140.22,68.22 141.3,69.3 141.3,73.2 142,73.9 GND-3.TP | OPT2.15 130.68,36.08 v130.7,36.1 | v130.7,28.4 130.65,28.45 OPT2.9 | OPT2.11 130.6,31 v130.7,30.9 | OPT2.13 130.66,33.53 v130.7,33.5 | C17.2 v148.2,94.4 | v150.7,94.4 C14.2 | 139.9,103.6 v138.3,103.6 | IC1.4 144.35,102.1 v145.3,102.1 | C1.2 v146.3,98.8 | 140.3,82.25 139.85,81.8 v139,81.8 | IC2.4 144.75,79.8 v145.5,79.8 | R95.1 129.4,64.55 129.4,63.28 | v138.3,43.9 C20.2 C19.2 v137.1,43.9 136.3,43.9 v130.7,38.3 | v144,23.1 144.05,23.15 J1.14 | 145.46,27.35 148.26,27.35 | 144.05,27.15 v144,27.1 144.05,27.15 J1.Z4 | 149.75,27.15 v149.8,27.2 149.75,27.15 J1.Z3 | 143.95,15.65 v143.9,15.6 145.41,15.6 J1.Z2 J1.Z1 149.75,15.65 v149.8,15.6 150.9,16.7 150.9,20.1 150.3,20.7 v149.9,20.7 149.85,20.65 J1.9 147.15,20.65 146.9,20.9 146.9,21.9 146.65,22.15 J1.12 J1.14 | v148.6,72.2 C18.2 | J1.16 J1.14
  Top 0.406: IC1.4 144.28,100.6 C3.2 | 144.81,99.01 C1.2 145.32,98.5 145.32,97.22 | IC2.4 144.68,78.33 C4.2 | 145.31,76.61 C2.2 | R14.2 140.3,82.25 R6.2 | C18.2 v146.27,73.78 145.42,74.62 | GND-5.TP 144.4,96.2 145.32,97.12 145.32,97.22 | C17.2 146.47,96.08 145.32,97.22
  Top 0.61: R12.2 139.9,103.6 140.15,103.35 R4.2 | C3.2 144.25,99.57 144.81,99.01 | C4.2 144.65,77.27 145.31,76.61 | C18.2 C15.2 | C2.2 145.42,74.62 144.7,73.9 GND-3.TP
  Top 1.016: v90.8,69.1 87.75,69.1 C10.2 | v92.3,51.3 87.95,51.3 87.65,51
  Top 1.27: C10.2 C13.2 C16.2 87.65,51 87.65,48.43 Z1.A 89.2,47.6 GND.TP
  Bottom 0.305: v132.5,98.3 v132.5,95.8 v132.5,93.2 v132.5,90.7 | v148.2,94.4 v150.7,94.4 | v146.27,73.78 146.24,73.8 146.2,73.8 | v144,27.1 v144,23.1 | v143.9,15.6 139,15.6 130.7,23.9 v130.7,28.4 v130.7,30.9 v130.7,33.5 v130.7,36.1 v130.7,38.3 | v148.3,60.9 148.6,61.2 v148.6,72.2 | v90.8,69.1 108.4,69.1 114.2,63.3 v121.1,63.3
  Bottom 5: v92.3,51.3 92.28,51.32 AC/DC1.-V 69.78,51.32 67.2,53.9 67.2,64.1 72.2,69.1 v90.8,69.1
  other vias: 151.1,4.1 151.8,115.7
  pour Top (isolate 0.254, no thermals): 128,121 158,121 158,114 158.4,113.6 158.4,-3 132,-3 132,19 126,25 126,45 119,52 119,69 128,78
  pour Bottom (isolate 0.254, no thermals): 128,121 158,121 158,114 158.9,113.1 158.9,-3 132,-3 132,19 126,25 126,45 119,52 119,69 128,78
I2C_SCL  (via drill 0.35 pad 0.45)
  Top 0.305: v140.9,47.5 140.9,48.65 IC4.8 | v141.1,29 141.1,21.29 142.24,20.15 J1.8
  Bottom 0.305: v141.1,29 141.1,47.3 v140.9,47.5
I2C_SDA  (via drill 0.35 pad 0.45)  (1 unrouted)
  Top 0.305: 148.35,19.7 v149.9,19.7 | v141.6,49 141.3,49.3 IC4.9
  Bottom 0.305: v149.9,19.7 142.9,19.7 141.7,20.9 141.7,48.9 v141.6,49
MCP_REL_RST  (via drill 0.35)
  Top 0.305: IC4.14 141.55,52.55 142.7,53.7 147.2,53.7 v147.5,54 | v150,23.6 149.95,23.65 J1.15
  Bottom 0.305: v147.5,54 147.5,48 149,46.5 149,24.6 v150,23.6
MUX_A  (via drill 0.35 pad 0.45)
  Top 0.305: IC4.25 v131.1,50.6 130.7,50.6 129.6,49.5 R93.4 | IC9.11 141.53,58.33 140.4,57.2 v140.4,56.1
  Bottom 0.305: v140.4,56.1 139,54.7 134.9,54.7 131.1,50.9 v131.1,50.6
MUX_B  (via drill 0.35 pad 0.45)
  Top 0.305: IC4.26 131.05,49.95 v130.45,49.35 130.4,49.3 R93.3 | IC9.10 140.88,58.48 139.7,57.3 v139.7,56.3
  Bottom 0.305: v139.7,56.3 138.7,55.3 134.4,55.3 130.45,51.35 v130.45,49.35
MUX_C  (via drill 0.35 pad 0.45)
  Top 0.305: IC4.27 131.6,49.3 131.2,48.9 v131.2,48.6 R93.2 | IC9.9 140.22,58.83 139,57.6 v139,56.6
  Bottom 0.305: v139,56.6 138.3,55.9 134,55.9 129.6,51.5 129.6,48.9 129.9,48.6 v131.2,48.6
MUX_EN  (via drill 0.35 pad 0.45)
  Top 0.305: IC4.28 132.45,48.65 v132.3,48.5 132,48.2 R93.1 | IC9.7 140.88,61.77 139.7,60.6 139.7,59.4 138.3,58 v138.3,56.9
  Bottom 0.305: v138.3,56.9 137.9,56.5 133.8,56.5 129,51.7 129,48.3 129.5,47.8 131.6,47.8 v132.3,48.5
N$1
  Top 0.305: IC9.5 142.18,65.03 142.7,64.5 R91.1
N$2
  Top 1.27: R16.2 84.4,72.4 82.35,70.35 C10.1 | R15.2 81.08,46.3 | 81.08,46.3 82.3,46.3 | 82.3,46.3 82.35,46.35 | 12VDC.TP 82.1,46.1 82.3,46.3 | Z1.C 81.08,46.3
  Top 4: C10.1 C13.1 | C13.1 C16.1 82.35,46.35 | AC/DC1.+V 80.37,59.32 C13.1
  pour Top (isolate 0.305, rank 2, no thermals): 72,62 80,62 80,72 84,72 84,45 80,45 80,56 72,56
N$3
  Top 2: R61.1 14.62,61.82 17.6,64.8 C21.2 17.6,73.49 R60.2
N$4
  Top 0.305: R21.1 123.08,78.23 119.83,74.98 118.18,74.98 117.3,74.1 117.3,60.3 115.2,58.2 IC3.14
N$5
  Top 0.508: R63.8 121.7,101.8 123,100.5 123,99.9 123.36,99.55 OPT1.1
N$6
  Top 0.305: R24.1 39.45,75.75 41.8,73.4 83,73.4 83.6,74 115,74 115.5,73.5 115.5,62.4 115.1,62 IC3.11
N$7
  Top 0.305: R23.1 67.56,74.94 68.5,74 82.9,74 83.39,74.5 115.5,74.5 116.1,73.9 116.1,61.2 115.64,60.74 IC3.12
N$8
  Top 0.305: R22.1 95.87,75.93 96.81,74.99 115.81,74.99 116.7,74.1 116.7,60.7 115.47,59.47 IC3.13
N$9
  Top 0.508: R63.7 121.1,101 121.5,100.6 121.5,97.6 122.09,97 OPT1.3
N$10
  Top 0.305: IC3.15 111.8,56.93 101.37,46.5 94.5,46.5 90.8,42.8 76.8,42.8 74.3,45.3 68.8,45.3 67.8,44.3 41.3,44.3 40.09,43.09 R20.1
N$11
  Top 0.305: IC3.16 111.5,55.66 101.64,45.8 94.8,45.8 91.1,42.1 76.5,42.1 74,44.6 69.2,44.6 68.3,43.7 41.7,43.7 40.2,42.2 40.2,41.77 R19.1
N$12  (via drill 0.35 pad 0.45)
  Top 0.508: IC6.2 10.73,108.64 11.9,109.8 13.4,109.8 v13.4,109.9
  Top 1.016: R33.2 v13.5,114.73 C24.1
  Bottom 0.508: v13.4,109.9 13.4,114.63 v13.5,114.73
N$13
  Top 0.305: IC3.17 111.2,54.39 101.91,45.1 95.1,45.1 91.5,41.5 76.1,41.5 73.6,44 69.62,44 R18.1
N$14
  Top 0.406: IC1.5 144.3,104.65 R7.2
N$15
  Top 0.305: IC3.18 110.9,53.12 102.28,44.5 96.98,44.5 R17.1
N$16
  Top 0.305: IC1.8 141.62,104.63 R8.1
N$17
  Top 0.508: R63.6 120.3,100.2 120.5,100 120.5,95 121.03,94.47 OPT1.5
N$18
  Top 0.61: R7.1 145.9,107 146.1,107.2 C8.1
N$19  (via drill 0.35 pad 0.45)
  Top 0.305: IC1.6 143.62,105.88 v143.6,105.9 | v138.9,100.6 R1.2
  Bottom 0.305: v143.6,105.9 143.6,102.7 141.5,100.6 v138.9,100.6
N$20
  Top 2: D10.C 19.1,55.1 18.2,56 D9.A 17.88,56.58 R61.2
N$21  (via drill 0.35 pad 0.45)
  Top 0.305: C6.1 142.88,106.22 v142.88,106 142.88,104.73 IC1.7 | R3.1 v137.6,102
  Bottom 0.305: v137.6,102 141.7,102 142.88,103.17 v142.88,106
N$22
  Top 0.508: IC6.3 9.46,108.77 11.45,110.75 C25.1
  Top 1.016: R34.2 C25.1
N$23
  Top 0.508: R63.5 119.3,95.3 118.9,94.9 118.9,93.1 119.5,92.5 121.8,92.5 122.4,91.9 125.36,91.9 OPT1.7
N$24
  Top 0.305: IC9.6 141.53,64.58 142.8,63.3 R92.1
N$25
  Top 0.61: 21.95,67.85 21.95,67.97 21.6,68.32 R62.2
  Top 1.27: C22.1 21.6,73.45 21.6,68.32 | IC5.1 25.03,56.42 25.03,59.94 24.4,60.57 24.4,65.4 21.95,67.85
N$26
  Top 2: D9.C 19.2,61.9 20.02,61.9 R62.1 21.4,59.5 D11.C
N$27
  Top 1.016: R37.1 R36.2
N$28
  Top 1.016: R38.1 R37.2
N$29
  Top 1.016: R39.1 16.2,105.09 R38.2
N$30
  Top 0.508: IC6.4 8.2,105.5 8.7,105 12.5,105 14.2,103.3 14.2,101.3 14.4,101.1 19.02,101.1
  Top 1.016: C26.1 R40.1 19.02,101.1 19.02,102.61 R39.2
N$31  (via drill 0.35 pad 0.45)
  Top 0.406: IC7.2 42.77,10.37 41,8.6 v40.1,8.6
  Top 1.016: C27.1 v40,4.58 37.46,4.58 R41.2
  Bottom 0.406: v40.1,8.6 40.1,4.67 v40,4.58
N$32
  Top 0.406: IC7.3 44.03,10.04 42.04,8.04 C28.1
  Top 1.016: R42.2 C28.1
N$33
  Top 1.016: R44.2 R45.1
N$34
  Top 1.016: R45.2 R46.1
N$35
  Top 1.016: R47.1 37.3,14.27 R46.2
N$36
  Top 0.406: IC7.4 45.3,13.49 44.9,13.9 39.3,13.9 38.8,14.4 38.8,17.6 38.2,18.2 34.46,18.2
  Top 1.016: R47.2 34.46,18.2 34.46,19.79 R48.1 C29.1
N$37
  Top 0.508: R64.8 121,39.4 122.2,38.2 122.2,37.7 122.56,37.34 OPT2.1
N$38
  Top 0.406: IC2.5 144.7,82.35 R9.2
N$39
  Top 0.406: IC2.8 142.02,82.33 R10.1
N$40  (via drill 0.3 pad 0.7, 0.35 pad 0.7)
  Top 0.508: R64.7 120.5,38.6 v120.8,38.3 | v121.4,34.9 121.5,34.8 OPT2.3
  Bottom 0.508: v120.8,38.3 121.3,37.8 121.3,35 v121.4,34.9
N$41
  Top 0.61: R9.1 146.3,84.6 146.6,84.9 C9.1
N$42
  Top 0.406: 140.3,85.7 C12.2
  Top 0.61: C12.2 140.8,85.95 | 140.8,85.95 R13.2 | R13.2 R10.2 141,84.15 | 141,84.15 R14.1 | R14.1 140.3,85.7 | R13.2 141,85.45 141,84.15 | R14.1 140.8,84.65 140.8,85.95 | R14.1 138.55,84.15 3VFB.TP
N$43  (via drill 0.3 pad 0.45)
  Top 0.406: IC2.6 144.03,83.42 v144.2,83.6 | v139.4,78.3 R2.2
  Bottom 0.406: v144.2,83.6 144.2,81.2 141.3,78.3 v139.4,78.3
N$44  (via drill 0.3 pad 0.45)
  Top 0.406: IC2.7 v143.38,83.5 143.38,84.03 C7.1 | v138.7,80.7 138.7,79.85 R5.1
  Bottom 0.406: v143.38,83.5 143.38,81.88 142.2,80.7 v138.7,80.7
N$45
  Top 0.305: IC1.1 142.2,102.05 R4.1
  Top 0.61: R3.2 139.7,102.05 R4.1
N$46
  Top 0.406: R6.1 142.6,79.75 IC2.1
  Top 0.61: R5.2 140.1,79.75 R6.1
N$47  (via drill 0.35 pad 0.45)
  Top 0.406: IC8.2 38.63,110.14 39.4,110.9 v41.5,110.9
  Top 1.016: C30.1 v41.5,115.03 R49.2
  Bottom 0.406: v41.5,110.9 v41.5,115.03
N$48
  Top 0.406: IC8.3 37.37,110.47 39.35,112.45 C31.1
  Top 1.016: R50.2 C31.1
N$49
  Top 1.016: R52.2 R53.1
N$50
  Top 1.016: R53.2 R54.1
N$51
  Top 1.016: R54.2 44.04,102.97 R55.1
N$52
  Top 0.406: IC8.4 36.09,105.7 36.5,105.3 41.2,105.3 42.3,104.2 42.3,102.1 43,101.4 46.93,101.4
  Top 1.016: R55.2 46.93,102.89 46.93,101.4 C32.1 R56.1
N$53  (via drill 0.3 pad 0.7, 0.35 pad 0.7)
  Top 0.508: R64.6 119.8,37.8 v120.1,37.5 | v120.5,32.3 120.53,32.27 OPT2.5
  Bottom 0.508: v120.1,37.5 120.4,37.2 120.4,32.4 v120.5,32.3
N$54  (via drill 0.3 pad 0.7, 0.35 pad 0.7)
  Top 0.508: R64.5 118.9,37 v119.4,36.5 | v120.3,29.9 120.47,29.73 OPT2.7
  Bottom 0.508: v119.4,36.5 119.4,30.8 v120.3,29.9
N$59  (via drill 0.35 pad 0.45)
  Top 0.406: IC10.2 65.94,110.03 66.6,110.7 v68.5,110.7
  Top 1.016: C36.1 v68.5,115.12 R65.2
  Bottom 0.406: v68.5,110.7 v68.5,115.12
N$60
  Top 0.406: IC10.3 64.66,110.56 66.66,112.56 C37.1
  Top 1.016: R66.2 C37.1
N$61
  Top 1.016: R68.2 R69.1
N$62
  Top 1.016: R69.2 R70.1
N$63
  Top 1.016: R70.2 71.34,103.07 R71.1
N$64
  Top 0.406: IC10.4 63.4,105.81 63.8,105.4 68.6,105.4 69.6,104.4 69.6,102 70.1,101.5 74.24,101.5
  Top 1.016: R71.2 74.24,101.5 74.24,99.91 R72.1 C38.1
N$65  (via drill 0.35 pad 0.45)
  Top 0.406: IC11.2 69.36,10.06 68.3,9 v66.6,9
  Top 1.016: C39.1 v66.6,4.67 R73.2
  Bottom 0.406: v66.6,9 v66.6,4.67
N$66
  Top 0.406: IC11.3 70.64,9.94 68.65,7.95 C40.1
  Top 1.016: R74.2 C40.1
N$67
  Top 1.016: R77.1 R76.2
N$68
  Top 1.016: R77.2 R78.1
N$69
  Top 1.016: R79.1 63.9,14.37 R78.2
N$70
  Top 0.406: IC11.4 71.91,13.79 71.6,14.1 66.5,14.1 65.3,15.3 65.3,18 65,18.3 61.16,18.3 61.06,18.2
  Top 1.016: R79.2 61.06,18.2 61.06,19.89 R80.1 61.08,21.52 61,21.6 61,22.08 C41.1
N$71  (via drill 0.35 pad 0.45)
  Top 0.406: IC12.2 93.73,110.14 94.4,110.8 v96.3,110.8
  Top 1.016: C42.1 v96.4,115.22 R81.2
  Bottom 0.406: v96.3,110.8 96.4,110.9 v96.4,115.22
N$72
  Top 0.406: IC12.3 92.47,110.67 94.46,112.66 C43.1
  Top 1.016: R82.2 C43.1
N$73
  Top 1.016: R84.2 R85.1
N$74
  Top 1.016: R85.2 R86.1
N$75
  Top 1.016: R86.2 99.14,103.17 R87.1
N$76
  Top 0.406: IC12.4 91.19,106.11 91.9,105.4 96.3,105.4 97.6,104.1 97.6,102.2 98.2,101.6 102.04,101.6
  Top 1.016: R87.2 102.04,101.6 102.04,100.01 R88.1 C44.1
N$83  (via drill 0.35 pad 0.45)
  Top 0.406: IC14.2 96.36,9.96 95.5,9.1 v93.4,9.1
  Top 1.016: R97.2 v93.4,4.78 C48.1
  Bottom 0.406: v93.4,9.1 v93.4,4.78
N$84
  Top 0.406: IC14.3 97.64,9.63 95.65,7.65 C49.1
  Top 1.016: C49.1 R98.2
N$85
  Top 1.016: R101.1 R100.2
N$86
  Top 1.016: R101.2 88,12.07 88,13.7 88.12,13.82 R102.1
N$87
  Top 1.016: R102.2 90.96,16.83 R103.1
N$88
  Top 0.406: IC14.4 98.91,13.99 98.7,14.2 93.1,14.2 92.2,15.1 92.2,18 91.6,18.6 88.08,18.6
  Top 1.016: C50.1 R104.1 88.08,18.6 88.08,16.91 R103.2
N$95  (via drill 0.35 pad 0.45)
  Top 0.406: IC16.2 123.86,9.37 123.3,8.8 v121.2,8.8
  Top 1.016: C54.1 v121.1,4.58 R113.2
  Bottom 0.406: v121.2,8.8 121.1,8.7 v121.1,4.58
N$96
  Top 0.406: IC16.3 125.14,8.94 123.5,7.3 123.5,7.18 C55.1
  Top 1.016: R114.2 C55.1
N$97
  Top 1.016: R117.1 R116.2
N$98
  Top 1.016: R117.2 R118.1
N$99
  Top 1.016: R119.1 118.4,14.27 R118.2
N$100
  Top 0.406: IC16.4 126.41,13.79 126.1,14.1 121.4,14.1 119.9,15.6 119.9,17.8 119.6,18.1 115.56,18.1
  Top 1.016: C56.1 R120.1 115.56,19.79 115.56,18.1 R119.2
OUT_1
  Top 1.016: R36.1 R34.1 21.71,112.47 23.13,111.05
  Top 2.54: R35.1 28.92,111.08 30.6,109.4 30.6,106.79 K1.4 | R35.1 23.13,111.05 K1.5 29.17,106.77 29.4,107 | R35.1 23.17,109.83 24.6,108.4 25.4,109.2 | 25.4,109.2 25.4,109.5 | 25.4,109.2 25.4,108.6 26,108 26.6,108.6 26.6,109.3 | 26.6,109.4 26.6,109.3 | 26.6,109.3 27.6,108.3 27.9,108.6 27.9,109 | 27.9,109.9 27.9,109 | 27.9,109 28.8,108.1 29.2,108.5 29.2,109 29.1,109
  Bottom 2.54: R25.1 23.13,111.01 K1.5 K1.4 30.62,109.38 28.92,111.08 R25.1 | R25.1 24.6,109.68 24.6,107.6 26.5,109.5 | 26.5,109.5 26.5,109.6 | 26.5,109.5 26.5,108.6 26.9,108.2 28,109.3 28.3,109.3 28.3,108.6 28.5,108.4
OUT_2
  Top 0.61: R51.1 51.27,109.8 | 51.35,111.2 50.8,111.2 50.6,111.4
  Top 1.016: 51,111 50.6,111.4 49.23,112.77 R50.1 R52.1
  Top 2.54: 51.27,109.8 51.27,106.59 K2.5 56.97,106.47 57.4,106.9 | K2.4 58.63,108.17 55.6,111.2 51.35,111.2 R51.1 53.2,109.35 53.2,108.5 | 53.2,108.1 53.2,108.5 | 53.2,108.5 54.2,109.5 55.2,108.5 55.2,107.9 55.4,107.9 56.2,108.7 56.2,108.4
  Bottom 2.54: R32.1 51,110.98 51,106.61 K2.5 K2.4 58.63,108.27 55.62,111.28 R32.1 | R32.1 52.7,109.88 52.7,107.7 | 52.7,107.3 52.7,107.7 | 52.7,107.7 55.2,110.2 55.2,108.2 55.4,108 55.6,108.2 56.8,108.2
OUT_3
  Top 1.016: R68.1 R66.1 76.33,112.87 77.82,111.38 R67.1
  Top 2.54: 80.7,108.7 81.3,109.3 81.4,109.3 82.5,108.2 82.5,109.4 83.1,110 86.33,106.77 K3.4 86.84,108.86 84.32,111.38 R67.1 78.57,107.55 K3.5 79.42,106.7 85.4,106.7 | 80.7,108.7 80.7,108.3 | 80.7,108.7 80.7,109.3 80.3,109.7
  Bottom 2.54: R31.1 78.6,107.52 K3.5 K3.4 86.84,108.86 84.32,111.38 R31.1 | R31.1 80.8,109.18 80.8,108.6 | 80.8,108.3 80.8,108.6 | 80.8,108.6 82.2,110 82.9,109.3 82.9,108.6 | 82.9,108.2 82.9,108.6 | 82.9,108.6 83.8,109.5 84.8,108.5 84.8,107.9
OUT_4
  Top 1.016: R83.1 105.92,111.48 104.43,112.97 R82.1 R84.1
  Top 2.54: R83.1 106.37,107.06 K4.5 112.87,106.97 113,107.1 | K4.4 113.95,108.75 111.22,111.48 R83.1 | R83.1 108.6,109.25 108.6,108.9 | 108.6,108.1 108.6,108.9 | 108.6,108.9 109.8,110.1 110.1,109.8 110.1,108.3 | 110.1,108 110.1,108.3 | 110.1,108.3 110.8,109 111.6,108.2
  Bottom 2.54: R30.1 106.4,107.03 K4.5 K4.4 113.95,108.75 111.22,111.48 R30.1 | R30.1 108.2,109.68 108.2,107.9 109.9,109.6 | 109.9,109.6 109.9,109.9 | 109.9,109.6 109.9,108.3 110.1,108.1 111.2,109.2 111.3,109.2 112.1,108.4
OUT_5
  Top 1.016: R43.1 30.98,8.32 32.47,6.83 R42.1 R44.1
  Top 2.54: K5.5 R43.1 25.48,8.32 22.7,11.1 22.7,13.07 K5.4 | K5.4 25.67,10.1 25.7,10.1 25.7,11.9 26.3,12.5 27.3,11.5 27.3,10.3 | 27.3,9.2 27.3,10.3 | 27.3,10.3 28.1,11.1 29,10.2 29,9.9 | K5.4 29.07,13.13 29.2,13
  Bottom 2.54: 30.13,8.67 K5.5 K5.4 | K5.4 22.64,11.16 25.48,8.32 R26.1 30.13,8.35 30.13,8.67 | K5.4 24.9,10.87 24.9,10.7 26.1,11.9 26.1,9.4 26.4,9.1 28.1,10.8 | 28.1,10.8 28.1,11.4 | 28.1,10.8 28.1,10.7 30.13,8.67
OUT_6
  Top 1.016: R75.1 56.88,8.42 58.37,6.93 R74.1 R76.1
  Top 2.54: K6.5 56.82,8.48 56.88,8.42 | R75.1 52.68,8.42 49.33,11.77 K6.4 | K6.4 51.26,11.2 52.3,11.2 53,11.9 53.6,11.3 53.6,9.9 55.1,11.4 | 55.2,11.5 55.1,11.4 | 55.1,11.4 55.1,10.1 | K6.4 55.57,13.13 55.7,13
  Bottom 2.54: K6.4 49.33,11.77 52.68,8.42 R27.1 56.82,8.94 K6.5 K6.4 | K6.4 52.76,9.7 53.2,9.7 53.2,11.8 | 53.2,11.8 52.9,12.1 | 53.2,11.8 55,10 55.1,10 55.1,11 55.7,11.6
OUT_7
  Top 1.016: R99.1 84.48,8.52 85.97,7.03 R98.1 R100.1
  Top 2.54: K7.4 K7.5 83.71,8.54 R99.1 78.68,8.52 76.22,10.98 K7.4 | K7.4 79.2,10.05 | 79.2,10.05 79.2,9.5 | 79.2,10.05 79.2,11.1 80.2,12.1 81,11.3 81,10.1 | 81,9.4 81,10.1 | 81,10.1 82,11.1 82,10.8 81.8,10.8
  Bottom 2.54: 77.2,13.03 K7.4 76.22,10.78 78.48,8.52 R28.1 K7.5 77.2,13.03 | 77.2,13.03 79.3,10.93 79.3,10.4 | 79.3,9.8 79.3,10.4 | 79.3,10.4 80.3,11.4 81.6,10.1 81.6,9.9 82.4,10.7 82.4,11.6
OUT_8
  Top 0.406: R115.1 110.55,9 110,9 | 110,8 110,9 | 109.6,10.1 110,9.7 110,9
  Top 1.016: R116.1 R114.1 113.47,6.83 111.98,8.32 111.6,8.32 R115.1
  Top 2.54: 105.4,11.4 105.5,11.5 106.2,11.5 108,9.7 108,10.9 108.4,11.3 109.6,10.1 109.7,10.1 109.7,11.2 110.8,12.3 110.07,13.03 K8.4 103.31,10.99 106,8.3 111.58,8.3 111.6,8.32 | R115.1 111.23,12.6 K8.5
  Bottom 2.54: K8.5 111.2,12.63 R29.1 106.08,8.32 103.31,11.09 K8.4 K8.5 | K8.5 110.8,11 109.2,9.4 107.6,11 105.3,11 106.8,9.5 107.5,9.5 109.7,11.7
REL_0
  Top 0.305: IC3.8 126.89,62.01 132.42,56.49 136.51,56.49 137.65,55.35 IC4.17
REL_1
  Top 0.305: IC4.18 137,55.3 136.31,55.99 132.21,55.99 127.46,60.74 IC3.7
REL_2
  Top 0.305: IC3.6 128.03,59.47 132.01,55.49 135.91,55.49 136.35,55.05 IC4.19
REL_3
  Top 0.305: IC4.20 135.7,54.6 135.3,55 131.8,55 128.6,58.2 IC3.5
REL_4
  Top 0.305: IC4.21 132.51,53.59 129.17,56.93 IC3.4
REL_5
  Top 0.305: IC4.22 132.75,52.55 129.64,55.66 IC3.3
REL_6
  Top 0.305: IC4.23 132.6,51.9 130.11,54.39 IC3.2
REL_7
  Top 0.305: IC3.1 130.48,53.12 132.35,51.25 IC4.24
RELAY_1
  Top 1.016: K1.1 35.88,81.77 D1.A 39.01,81.91 R24.2
RELAY_2
  Top 1.016: K2.1 59.14,81.98 D2.A 67.05,81.98 R23.2
RELAY_3
  Top 0.406: 91.94,82.36 D3.A 93.1,81.57 95.7,81.57 R22.2
  Top 1.016: K3.1 91.34,81.77 | 91.34,81.77 91.94,82.36 | 91.34,81.77 95.5,81.77 95.7,81.57
RELAY_4
  Top 1.016: K4.1 115.6,83.62 D4.A 122.03,83.62 R21.2
RELAY_5
  Top 0.305: R20.2 33,42.16 33,36.8 31.9,35.7 25.06,35.7 K5.1
  Top 1.016: 17.06,38.43 D5.A 17.8,38.13 K5.1
RELAY_6
  Top 1.016: R19.2 40.99,38.14 D6.A 43.99,38.13 K6.1
RELAY_7
  Top 1.016: K7.1 71.33,38.03 D7.A 68.53,38.19 R18.2
RELAY_8
  Top 1.016: K8.1 D8.A 95.26,38.02 R17.2
SW3
  Top 0.406: IC2.3 144.03,80.72 144.3,81 146.9,81 148.65,82.75 149.2,82.75 | 149.2,82.75 L2.1 | C9.2 149.15,84.8 149.15,82.8 149.2,82.75
  Top 0.61: SW3.TP 149.15,87.35 149.15,84.8 | C9.2 149.15,82.8
SW5
  Top 0.406: IC1.3 143.62,103.35 146.4,103.35 148.1,105.05 149.4,105.05 L1.1
  Top 0.61: 149.4,105.05 148.75,105.7 C8.2 148.75,110.05 SW.TP
TX_CH1  (via drill 0.35 pad 0.7)
  Top 0.508: IC6.6 9.46,96.33 18.5,87.3 118.8,87.3 120.4,88.9 v121.7,88.9 | v122.6,98.2 122.67,98.28 OPT1.2
  Bottom 0.508: v121.7,88.9 122.4,89.6 122.4,98 v122.6,98.2
TX_CH2  (via drill 0.3 pad 0.7, 0.35 pad 0.7)
  Top 0.508: IC8.6 37.37,90.23 39.2,88.4 117.9,88.4 119.3,89.8 v120.8,89.8 | v121.5,95.7 121.53,95.73 OPT1.4
  Bottom 0.508: v121.5,95.7 121,95.2 121,90 v120.8,89.8
TX_CH3  (via drill 0.35 pad 0.7)
  Top 0.508: IC10.6 64.66,90.44 65.5,89.6 117.5,89.6 118.6,90.7 v119.6,90.7 | v119.9,94.1 120.81,93.19 OPT1.6
  Bottom 0.508: v119.9,94.1 119.6,93.8 v119.6,90.7
TX_CH4
  Top 0.508: IC12.6 92.47,91.53 93.3,90.7 115.3,90.7 116.3,91.7 121.4,91.7 122.44,90.66 OPT1.8
TX_CH5
  Top 0.508: OPT2.2 120.47,36.08 112.7,28.3 49.7,28.3 44.03,22.64 IC7.6
TX_CH6
  Top 0.508: OPT2.4 119.44,33.53 113.2,27.3 76.3,27.3 70.64,21.64 IC11.6
TX_CH7
  Top 0.508: OPT2.6 118.59,31 113.9,26.3 100.5,26.3 97.64,23.43 IC14.6
TX_CH8
  Top 0.508: IC16.6 125.14,21.16 123.38,22.92 OPT2.8
TX_MUX1  (via drill 0.35 pad 0.45)
  Top 0.305: IC9.4 142.82,67.88 v142.5,68.2 R89.1 | OPT1.16 132.85,99.55 135.6,96.8 135.6,75.5 140.4,70.7 v140.4,69.9
  Bottom 0.305: v140.4,69.9 142.1,68.2 v142.5,68.2
TX_MUX2  (via drill 0.35 pad 0.45)
  Top 0.305: IC9.3 v143.47,67.5 143.47,68.12 143.3,68.3 R89.2 | OPT1.14 134.4,97 135.1,96.3 135.1,75.2 139.79,70.5 v139.79,69.5
  Bottom 0.305: v139.79,69.5 141.79,67.5 v143.47,67.5
TX_MUX3  (via drill 0.35 pad 0.45)
  Top 0.305: IC9.2 v144.12,66.8 144.12,69.17 R89.3 | OPT1.12 133.63,94.47 134.6,93.5 134.6,74.8 139.2,70.2 v139.2,69.1
  Bottom 0.305: v139.2,69.1 141.5,66.8 v144.12,66.8
TX_MUX4  (via drill 0.35 pad 0.45)
  Top 0.305: IC9.1 144.78,66.2 | 144.78,66.2 144.78,67.97 145,68.2 145,69.1 R89.4 | OPT1.10 133.47,91.92 134.1,91.3 134.1,74.3 138.6,69.8 v138.6,68.7 | v145.4,66.1 144.88,66.1 144.78,66.2
  Bottom 0.305: v138.6,68.7 141.2,66.1 v145.4,66.1
TX_MUX5  (via drill 0.35 pad 0.45)
  Top 0.305: IC9.15 v144.12,57.52 144,57.4 R90.1 | OPT2.16 131.72,37.34 134.72,34.34 140.44,34.34 143.8,37.7 v143.8,52.4
  Bottom 0.305: v143.8,52.4 143.8,57.2 v144.12,57.52
TX_MUX6  (via drill 0.35 pad 0.45)
  Top 0.305: IC9.14 143.47,57.77 v143.3,57.6 143.2,57.5 R90.2 | OPT2.14 133.52,34.8 134.52,33.8 140.71,33.8 144.29,37.4 144.29,51.33 v144.47,51.5
  Bottom 0.305: v143.3,57.6 143.13,57.43 143.13,52.16 143.86,51.43 144.4,51.43 v144.47,51.5
TX_MUX7  (via drill 0.35 pad 0.45)
  Top 0.305: IC9.13 142.82,58.02 142.4,57.6 | R90.3 142.4,57.6 | OPT2.12 133.72,32.27 134.62,33.16 140.87,33.16 144.86,37.16 144.86,50.6 v144.96,50.7 | v142.4,57.5 142.4,57.6
  Bottom 0.305: v144.96,50.7 143.6,50.7 142.4,51.9 v142.4,57.5
TX_MUX8  (via drill 0.35 pad 0.45)
  Top 0.305: IC9.12 142.18,58.17 141.6,57.6 v141.6,57.4 R90.4 | OPT2.10 132.02,29.73 134.92,32.62 141.13,32.62 145.36,36.86 145.36,49.73 v145.63,50
  Bottom 0.305: v145.63,50 143.3,50 141.6,51.7 v141.6,57.4
UART0_RX  (via drill 0.35 pad 0.45)
  Top 0.305: v143.5,21.1 143.55,21.15 J1.10
UART0_TX  (via drill 0.35 pad 0.45)
  Top 0.305: v150,21.6 149.95,21.65 J1.11 | v147.5,62.3 147.5,63.25 R92.2 R91.2
  Bottom 0.305: v150,21.6 144.4,21.6 142.4,23.6 142.4,47 143.6,48.2 145.7,48.2 146.5,49 146.5,61.3 v147.5,62.3

## Text on the board
tPlace: DO NOT TOUCH | AC IN | DO NOT TOUCH | Relay Board REV 2.0 | OUT1 | OUT2 | OUT3 | OUT4 | OUT5 | OUT6 | OUT7 | OUT8
tNames: github.com/DvidMakesThings/HW_10-In-Rack_PDU / David Sipos @2025